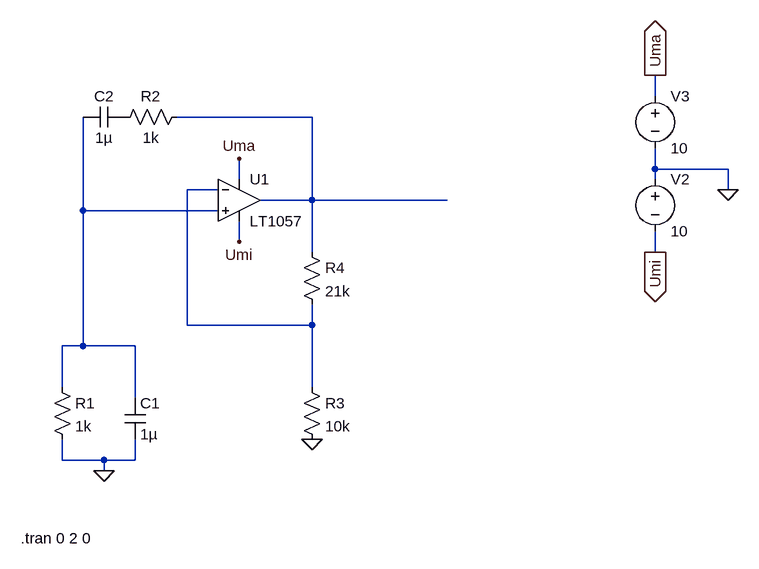
[diagram p0: schematic OpAmpWienBridge.asc]
OpAmpWienBridge.asc, the LTspice schematic file:
Version 4
SHEET 1 932 680
WIRE 800 -144 800 -176
WIRE 272 -112 64 -112
WIRE 800 -32 800 -64
WIRE 912 -32 800 -32
WIRE 160 -16 160 -48
WIRE 800 -16 800 -32
WIRE 128 0 80 0
WIRE 912 0 912 -32
WIRE 272 16 272 -112
WIRE 272 16 192 16
WIRE 480 16 272 16
WIRE -80 32 -80 -112
WIRE 128 32 -80 32
WIRE 160 80 160 48
WIRE 272 96 272 16
WIRE 800 96 800 64
WIRE 80 208 80 0
WIRE 272 208 272 176
WIRE 272 208 80 208
WIRE -80 240 -80 32
WIRE -80 240 -112 240
WIRE 0 240 -80 240
WIRE -112 304 -112 240
WIRE 272 304 272 208
WIRE 0 320 0 240
WIRE -112 416 -112 384
WIRE -48 416 -112 416
WIRE 0 416 0 384
WIRE 0 416 -48 416
WIRE -48 432 -48 416
FLAG -48 432 0
FLAG 272 384 0
FLAG 912 0 0
FLAG 160 -48 Uma
FLAG 160 80 Umi
FLAG 800 -176 Uma
IOPIN 800 -176 Out
FLAG 800 96 Umi
IOPIN 800 96 Out
SYMBOL res 256 288 R0
SYMATTR InstName R3
SYMATTR Value 10k
SYMATTR SpiceLine tol=1 pwr=0.1
SYMBOL res 80 -128 R90
WINDOW 0 0 56 VBottom 2
WINDOW 3 32 56 VTop 2
SYMATTR InstName R2
SYMATTR Value 1k
SYMATTR SpiceLine tol=1 pwr=0.1
SYMBOL voltage 800 -32 R0
WINDOW 123 0 0 Left 2
WINDOW 39 0 0 Left 2
SYMATTR InstName V2
SYMATTR Value 10
SYMBOL Opamps\\LT1057 160 -48 R0
SYMATTR InstName U1
SYMBOL voltage 800 -160 R0
WINDOW 123 0 0 Left 2
WINDOW 39 0 0 Left 2
SYMATTR InstName V3
SYMATTR Value 10
SYMBOL res 256 80 R0
SYMATTR InstName R4
SYMATTR Value 21k
SYMATTR SpiceLine tol=1 pwr=0.1
SYMBOL res -128 288 R0
SYMATTR InstName R1
SYMATTR Value 1k
SYMATTR SpiceLine tol=1 pwr=0.1
SYMBOL cap -16 -128 R90
WINDOW 0 0 32 VBottom 2
WINDOW 3 32 32 VTop 2
SYMATTR InstName C2
SYMATTR Value 1µ
SYMATTR SpiceLine V=25 Irms=3.41 Rser=0.0133158 Lser=0 mfg="KEMET" pn="C1206C105K3RAC" type="X7R"
SYMBOL cap -16 320 R0
SYMATTR Value 1µ
SYMATTR InstName C1
SYMATTR SpiceLine V=25 Irms=3.57 Rser=0.0376432 Lser=0 mfg="KEMET" pn="C1812C105K3RAC" type="X7R"
TEXT -176 536 Left 2 !.tran 0 2 0

The netlist it stands for:
* OpAmpWienBridge.asc
R3 N002 0 10k tol=1 pwr=0.1
R2 N001 P001 1k tol=1 pwr=0.1
V2 0 Umi 10
XU1 N003 N002 Uma Umi N001 LT1057  ; pins In+ In- V+ V- OUT
V3 Uma 0 10
R4 N001 N002 21k tol=1 pwr=0.1
R1 N003 0 1k tol=1 pwr=0.1
C2 P001 N003 1µ V=25 Irms=3.41 Rser=0.0133158 Lser=0 mfg="KEMET" pn="C1206C105K3RAC" type="X7R"
C1 N003 0 1µ V=25 Irms=3.57 Rser=0.0376432 Lser=0 mfg="KEMET" pn="C1812C105K3RAC" type="X7R"
.tran 0 2 0
.lib LTC.lib
.backanno
.end